# EAGLE design Libbrecht-Hall v3 (EAGLE 9.6.2)
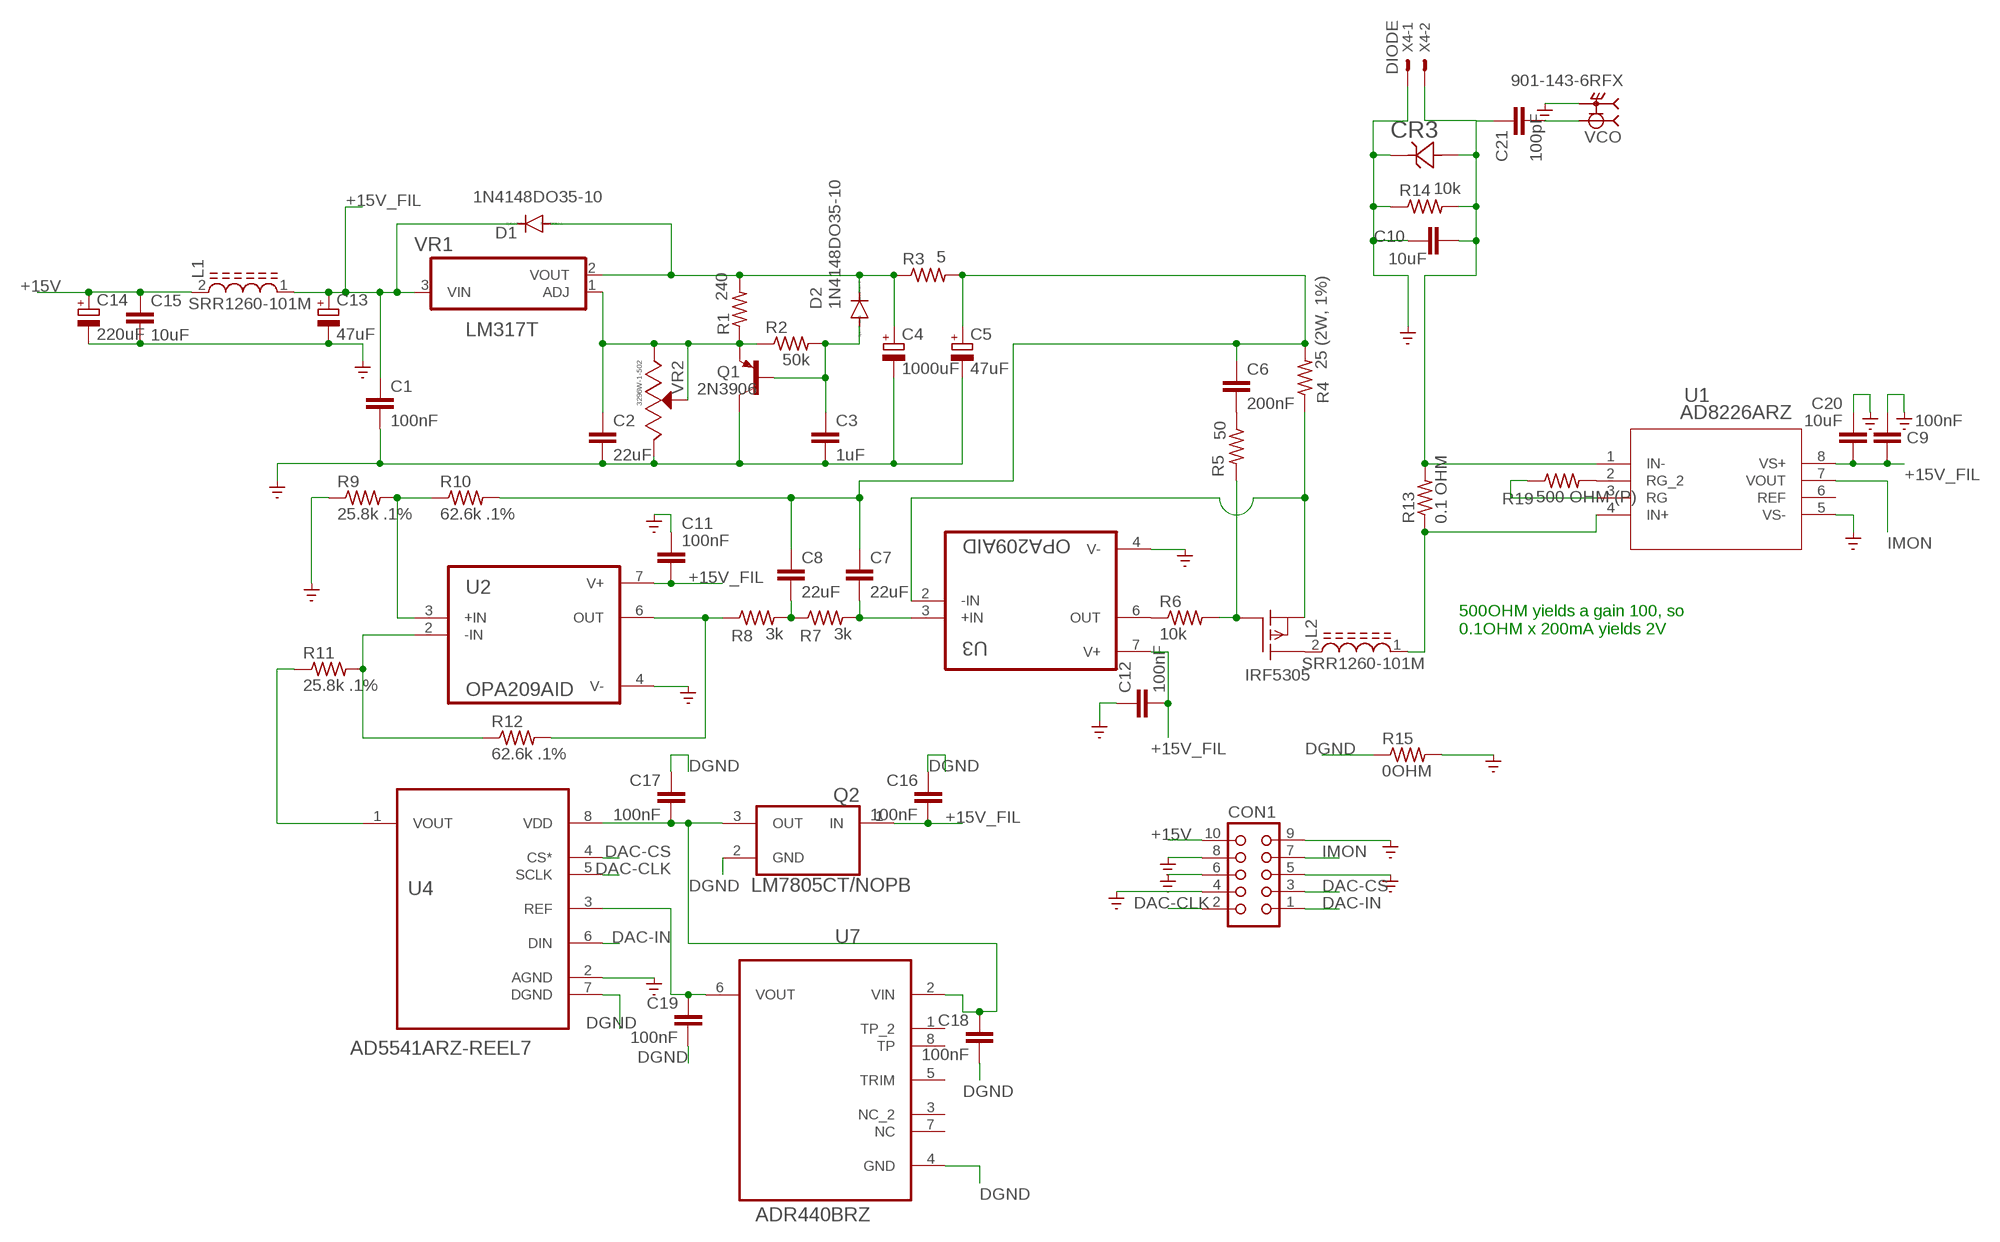
[diagram p0: schematic, sheet 1]

## Parts
C1  100nF  C-EUC1206  [C1206]
C2  22uF  C-EUC1206  [C1206]
C3  1uF  C-EUC1206  [C1206]
C4  1000uF  CPOL-EUE5-13  [E5-13]
C5  47uF  CPOL-EU175TMP-0808  [175TMP-0808]
C6  200nF  C-EUC1206  [C1206]
C7  22uF  C-EUC1206  [C1206]
C8  22uF  C-EUC1206  [C1206]
C9  100nF  C-EUC0603  [C0603]
C10  10uF  C-EUC1206  [C1206]
C11  100nF  C-EUC1206  [C1206]
C12  100nF  C-EUC1206  [C1206]
C13  47uF  CPOL-EU175TMP-0808  [175TMP-0808]
C14  220uF  CPOL-EUE3.5-8  [E3,5-8]
C15  10uF  C-EUC1206  [C1206]
C16  100nF  C-EUC1206  [C1206]
C17  100nF  C-EUC1206  [C1206]
C18  100nF  C-EUC1206  [C1206]
C19  100nF  C-EUC1206  [C1206]
C20  10uF  C-EUC0603  [C0603]
C21  100pF  C-EUC0603  [C0603]
CON1  CON10  [CON10]
CR3  ESDA7P60-1U1MZDO_1610_STM-M  [ZDO_1610_STM-M]
D1  1N4148DO35-10  [DO35-10]
D2  1N4148DO35-10  [DO35-10]
IRF5305  IRF9530  [TO220]
L1  SRR1260-101M  [INDP125125X600N]
L2  SRR1260-101M  [INDP125125X600N]
Q1  2N3906  [TO92]
Q2  LM7805CT/NOPB  [TO254P1054X470X2600-3]
R1  240  R-US_R1206  [R1206]
R2  50k  R-US_R1206  [R1206]
R3  5  R-US_R1206  [R1206]
R4  25 (2W, 1%)  R-US_R1206  [R1206]
R5  50  R-US_R1206  [R1206]
R6  10k  R-US_R1206  [R1206]
R7  3k  R-US_R1206  [R1206]
R8  3k  R-US_R1206  [R1206]
R9  25.8k .1%  R-US_R0603  [R0603]
R10  62.6k .1%  R-US_R0603  [R0603]
R11  25.8k .1%  R-US_R0603  [R0603]
R12  62.6k .1%  R-US_R0603  [R0603]
R13  0.1 OHM  R-US_R1206  [R1206]
R14  10k  R-US_R1206  [R1206]
R15  0OHM  R-US_R1206  [R1206]
R19  500 OHM (P)  R-US_R1206  [R1206]
U1  AD8226ARZ  [R_8_ADI]
U2  OPA209AID  [SOIC127P599X175-8N]
U3  OPA209AID  [SOIC127P599X175-8N]
U4  AD5541ARZ-REEL7  [SOIC127P600X175-8N]
U7  ADR440BRZ  [SOIC127P600X175-8N]
VCO  901-143-6RFX  [AMPHENOL_901-143-6RFX]
VR1  LM317T  [TO254P1054X470X1955-3]
VR2  3296W-1-502  [TRIM_3296W-1-502]
X4  DIODE  JST-XH-02-PIN-LONG-PAD  [JST-XH-02-PACKAGE-LONG-PAD]

## Nets
+15V: C14.+ C15.1 CON1.10 L1.2
+15V_FIL: C1.1 C9.2 C11.2 C12.2 C13.+ C16.2 C20.2 D1.C L1.1 Q2.1(IN) U1.8(VS+) U2.7(V+) U3.7(V+) VR1.3(VIN)
DAC-CLK: CON1.2 U4.5(SCLK)
DAC-CS: CON1.3 U4.4(CS*)
DAC-IN: CON1.1 U4.6(DIN)
DGND: C16.1 C17.1 C18.2 C19.2 Q2.2(GND) R15.1 U4.7(DGND) U7.4(GND)
GND: C1.2 C2.2 C3.2 C4.- C5.- C9.1 C10.1 C11.1 C12.1 C13.- C14.- C15.2 C20.1 CON1.4 CON1.5 CON1.6 CON1.8 CON1.9 CR3.1 Q1.1(C) R9.1 R14.1 R15.2 U1.5(VS-) U2.4(V-) U3.4(V-) U4.2(AGND) VCO.S1 VCO.S2 VCO.S3 VCO.S4 VR2.3(CW) X4.1 ; supply symbol labelled SUPPLY0_GND_
IMON: CON1.7 U1.7(VOUT)
N$1: R11.1 U4.1(VOUT)
N$2: L2.1 R13.1 U1.4(IN+)
N$3: C5.+ C6.1 C7.1 C8.1 R3.2 R4.2 R10.2
N$4: C4.+ D1.A D2.C R1.2 R3.1 VR1.2(VOUT)
N$5: C2.1 Q1.3(E) R1.1 R2.1 VR1.1(ADJ) VR2.1(CCW) VR2.2(WIPER)
N$6: C10.2 C21.1 CR3.2 R13.2 R14.2 U1.1(IN-) X4.2
N$7: C3.1 D2.A Q1.2(B) R2.2
N$8: R6.1 U3.6(OUT)
N$9: R9.2 R10.1 U2.3(+IN)
N$10: C21.2 VCO.1
N$11: C6.2 R5.1
N$12: R19.2 U1.2(RG_2)
N$13: C19.1 U4.3(REF) U7.6(VOUT)
N$14: C17.2 C18.1 Q2.3(OUT) U4.8(VDD) U7.2(VIN)
N$15: IRF5305.2(D) L2.2
N$18: R19.1 U1.3(RG)
N$20: IRF5305.3(S) R4.1 U3.2(-IN)
N$21: C8.2 R7.1 R8.2
N$22: C7.2 R7.2 U3.3(+IN)
N$25: R11.2 R12.1 U2.2(-IN)
N$26: R8.1 R12.2 U2.6(OUT)
N$28: IRF5305.1(G) R5.2 R6.2
Unconnected: U1.6(REF) U7.1(TP_2) U7.3(NC_2) U7.5(TRIM) U7.7(NC) U7.8(TP)

## Notes on the sheet
- 500OHM yields a gain 100, so
  0.1OHM x 200mA yields 2V

## Library data of the parts
C1-C3 C6-C12 C15-C21 = rcl:C-EU: CAPACITOR, European symbol; SPICEPREFIX: C
C4 C5 C13 C14 = rcl:CPOL-EU: POLARIZED CAPACITOR, European symbol; SPICEPREFIX: C
CON1 = con-harting:CON10: CONNECTOR; OC_FARNELL: unknown; OC_NEWARK: unknown
CR3 = ESDA7P60:ESDA7P60-1U1M: STMicro ESD Suppressor / TVS Diode; BUILT_BY: EMA_Cory; COPYRIGHT: Copyright (C) 2018 Accelerated Designs. All rights reserved; DATASHEET: https://www.st.com/content/ccc/resource/technical/document/datasheet/44/e9/26/44/42/ee/4f/e5/DM00139972.pdf/files/DM00139972.pdf/jcr:content/translations/en.DM00139972.pdf; MANUFACTURER_PART_NUMBER: ESDA7P60-1U1M; SOURCELIBRARY: Updates_to_database_2020-11-02; VENDOR: STMicroelectronics
D1 D2 = diode:1N4148: DIODE high speed (Philips)
IRF5305 = transistor-fet:IRF9530: P-Channel Enhancement MOSFET (HEXFET); -100V; -12A; 0,3Ohm
L1 L2 = SRR1260-101M:SRR1260-101M: Inductor Power Shielded Wirewound 33uH 20% 100KHz 27Q-Factor Ferrite 3A 60mOhm DCR T/R Check prices <https://pricing.snapeda.com/parts/SRR1260-101M/Bourns/view-part?ref=eda>; AVAILABILITY: Good; DESCRIPTION: 100µH Shielded Wirewound Inductor 1.7A 180mOhm Max Nonstandard; MF: Bourns; MP: SRR1260-101M; PACKAGE: Nonstandard Bourns; PRICE: None; PURCHASE-URL: https://pricing.snapeda.com/search/part/SRR1260-101M/?ref=eda
Q1 = transistor-pnp:2N3906: PNP Transistor
Q2 = LM7805CT_NOPB:LM7805CT/NOPB: Standard Regulator Pos 5V 1A 3-Pin(3+Tab) TO-220 Rail Check prices <https://pricing.snapeda.com/parts/LM7805CT/ON%20Semiconductor/view-part?ref=eda>; AVAILABILITY: Warning; DESCRIPTION: Linear Voltage Regulator IC Positive Fixed 1 Output 1A TO-220-3; MF: ON Semiconductor; MP: LM7805CT; PACKAGE: TO-220-3 ON Semiconductor; PRICE: None; PURCHASE-URL: https://pricing.snapeda.com/search/part/LM7805CT/?ref=eda
R1-R15 R19 = rcl:R-US_: RESISTOR, American symbol; SPICEPREFIX: R
U1 = AD8226ARZ:AD8226ARZ: AD8226 ARZ INSTRUMENTATION AMPLIFIER; COPYRIGHT: Copyright (C) 2021 Ultra Librarian. All rights reserved.; DIGI-KEY_PART_NUMBER_1: AD8226ARZ-ND; MANUFACTURER_PART_NUMBER: AD8226ARZ; MFR_NAME: Analog Devices Inc
U2 U3 = OPA209AID:OPA209AID; AVAILABILITY: Unavailable; DESCRIPTION: Single, 2.2nV/rtHz, 18MHz, Precision, RRO, 36V Operational Amplifier 8-SOIC -40 to 125; MF: Texas Instruments; MP: OPA209AID; PACKAGE: SOIC-8 Texas Instruments; PRICE: None; PURCHASE-URL: https://pricing.snapeda.com/search/part/OPA209AID/?ref=eda
U4 = AD5541ARZ-REEL7:AD5541ARZ-REEL7: 16-Bit Digital-to-Analog Converters Check prices <https://pricing.snapeda.com/parts/AD5541ARZ/Analog%20Devices/view-part?ref=eda>; AVAILABILITY: Warning; DESCRIPTION: 16 Bit Digital to Analog Converter 1 8-SOIC; MF: Analog Devices; MP: AD5541ARZ; PACKAGE: SOIC-8 Analog Devices; PRICE: None; PURCHASE-URL: https://pricing.snapeda.com/search/part/AD5541ARZ/?ref=eda
U7 = ADR440BRZ:ADR440BRZ: LDO XFET Voltage References; AVAILABILITY: Unavailable; DESCRIPTION: Series Voltage Reference IC ±0.05% 8-SOIC; MF: Analog Devices; MP: ADR440BRZ; PACKAGE: SOIC-8 Analog Devices; PRICE: None
VCO = 901-143-6RFX:901-143-6RFX: connector, rf coaxial, sma rt angle pcb jack recept, 4 legs, blunt post term, gold Check prices <https://pricing.snapeda.com/parts/901-143-6RFX/Amphenol%20RF/view-part?ref=eda>; AVAILABILITY: In Stock; DESCRIPTION: SMA Connector Jack, Female Socket 50Ohm Through Hole, Right Angle Solder; MF: Amphenol RF; MP: 901-143-6RFX; PACKAGE: None; PRICE: None
VR1 = LM317T:LM317T: Check prices <https://pricing.snapeda.com/parts/LM317T/Texas%20Instruments/view-part?ref=eda>; AVAILABILITY: In Stock; DESCRIPTION: 1.5-A, 40-V, adjustable linear voltage regulator 3-TO-220; MF: Texas Instruments; MP: LM317T; PACKAGE: TO-220-3 Texas Instruments; PRICE: None
VR2 = 3296W-1-502:3296W-1-502: Res Cermet Trimmer 500K Ohm 10% 0.5W 25(Elec)Turn 2.19mm (9.53 X 4.83 X 11.55mm) Pin Thru-Hole Tube; DESCRIPTION: 5 kOhms 0.5W, 1/2W PC Pins Through Hole Trimmer Potentiometer Cermet 25 Turn Top Adjustment; DIGI-KEY_PART_NUMBER: 3296W-1-502RLFTR-ND; MF: Bourns; MP: 3296W-1-502; PACKAGE: SOT-23-5 Bourns
X4 = Rembrandt Electronics - JST XH Connectors v1-0:JST-XH-02-PIN: JST XH Connector 2 Pin Wire to board connector. Pitch: 2,54 mm, (0.100") Number of pins: 2 Created by Rembrandt Electronics www.rembrandtelectronics.com

## Net classes
0 default: width 0.14 mm

## Board
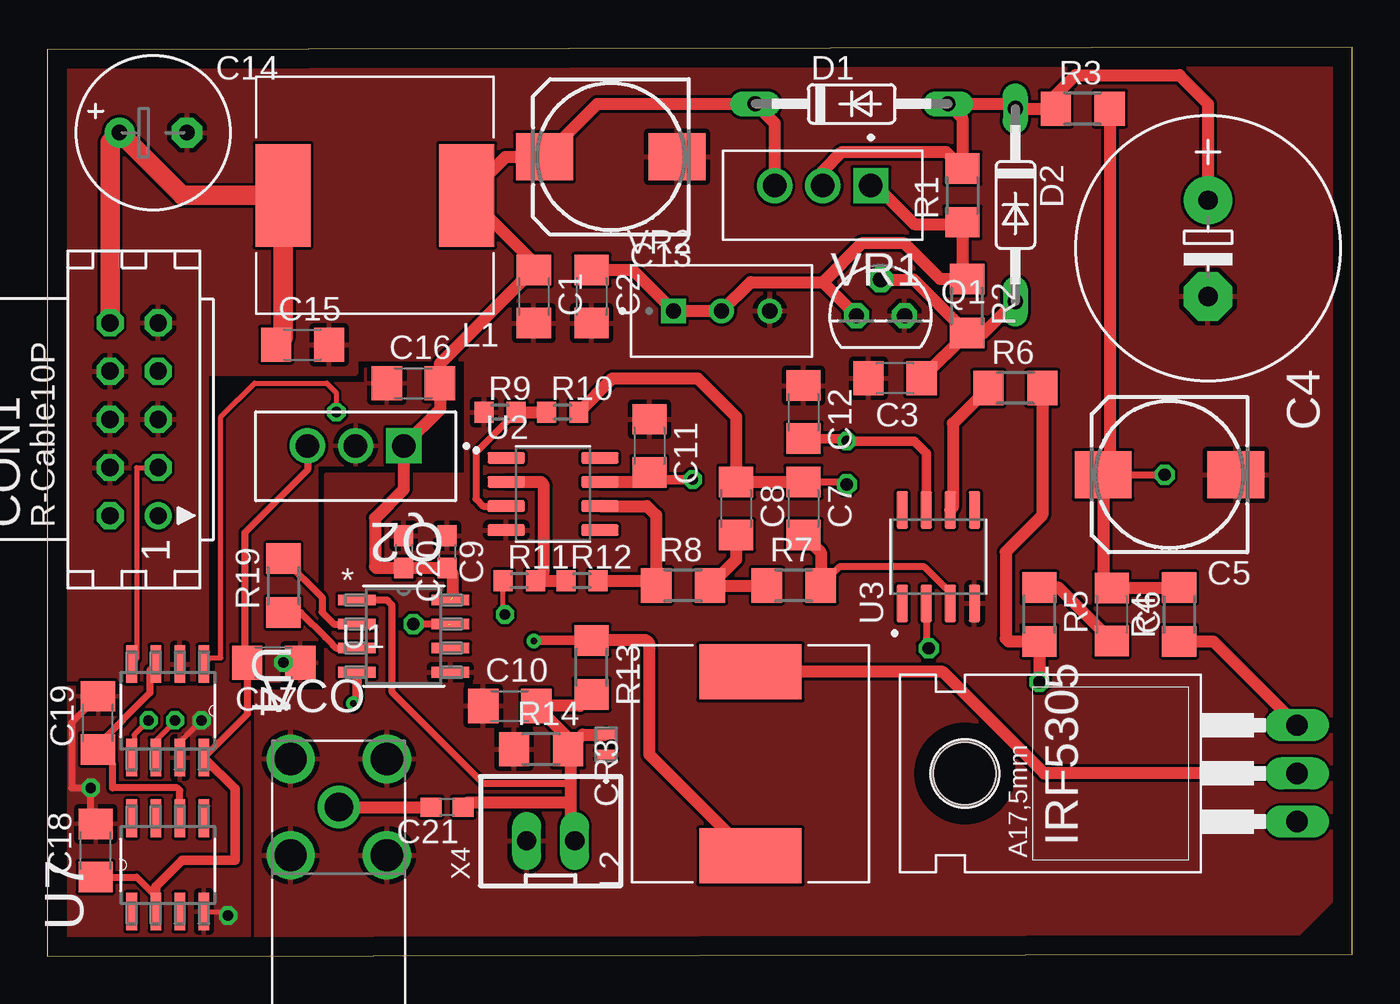
[diagram p1: board, top side]
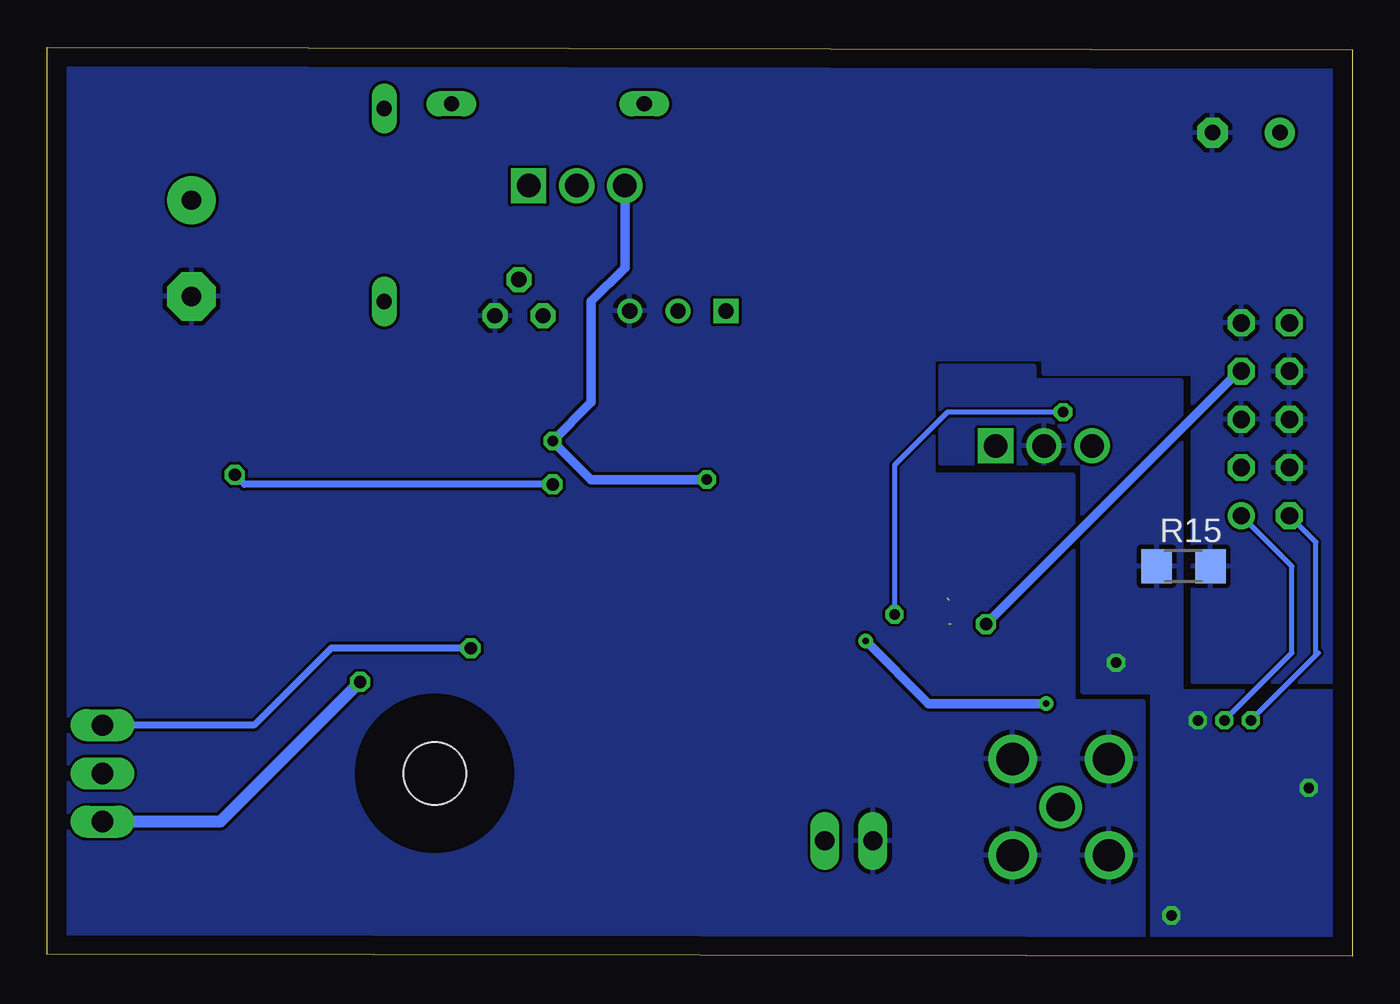
[diagram p2: board, bottom side, seen from below]

Size 68.81 x 47.93 mm. Coordinates in mm from the lower left corner, seen from the top.
Outline: 0,0 68.81,0.13 68.81,47.93 0,47.8 0,0
Copper layers (1*16): Top 0.035mm / dielectric 1.5mm / Bottom 0.035mm
Design rules "default": minimum track width 6mil, minimum drill 0.35mm, track to track 6mil, track to pad 6mil, pad to pad 6mil, via to via 6mil, smd to smd 6mil, copper to edge 40mil, drill to drill 6mil, minimum pad ring 10mil, minimum via ring 8mil, stop-mask expansion 4mil, vias tented up to drill 0mil, thermal gap 10mil

### Footprints (pad centres in the part's own frame; a part is rotated, then mirrored left to right if it is on the bottom)
C1206 = smd 1.6 x 1.8: 1 -1.4,0; 2 1.4,0
E5-13 = drill 1.016 pad 2.54: + -2.54,0 | drill 1.016 pad 2.54 octagon: - 2.54,0
175TMP-0808 = smd 3 x 2.5: + 3.5,0; - -3.5,0
C0603 = smd 1.1 x 1: 1 -0.85,0; 2 0.85,0
E3,5-8 = drill 0.813 pad 1.6: + -1.778,0 | drill 0.813 pad 1.6 octagon: - 1.778,0
CON10 = drill 0.914: 1 -5.08,-1.27 | drill 0.914 octagon: 2 -5.08,1.27; 3 -2.54,-1.27; 4 -2.54,1.27; 5 0,-1.27; 6 0,1.27; 7 2.54,-1.27; 8 2.54,1.27; 9 5.08,-1.27; 10 5.08,1.27
ZDO_1610_STM-M = smd 0.508 x 0.889: 1 -0.521,0; 2 0.521,0
DO35-10 = drill 0.813 long: A 5.08,0; C -5.08,0
TO220 = drill 1.118 long: 1 -2.54,-6.35; 2 0,-6.35; 3 2.54,-6.35 | hole 3.302: 0,11.176
INDP125125X600N = smd 2.9 x 5.4: 1 -4.85,0; 2 4.85,0
TO92 = drill 0.813 octagon: 1 1.27,0; 2 0,1.905; 3 -1.27,0
TO254P1054X470X2600-3 = drill 1.24 square: 1 0,0 | drill 1.24: 2 2.54,0; 3 5.08,0
R1206 = smd 1.6 x 1.803: 1 -1.422,0; 2 1.422,0
R0603 = smd 1 x 1.1: 1 -0.85,0; 2 0.85,0
R_8_ADI = smd 1.981 x 0.559: 1 -2.464,1.905; 2 -2.464,0.635; 3 -2.464,-0.635; 4 -2.464,-1.905; 5 2.464,-1.905; 6 2.464,-0.635; 7 2.464,0.635; 8 2.464,1.905
SOIC127P599X175-8N = smd 1.97 x 0.6: 1 -2.47,1.905; 2 -2.47,0.635; 3 -2.47,-0.635; 4 -2.47,-1.905; 5 2.47,-1.905; 6 2.47,-0.635; 7 2.47,0.635; 8 2.47,1.905
SOIC127P600X175-8N = smd 1.981 x 0.559: 1 -2.464,1.905; 2 -2.464,0.635; 3 -2.464,-0.635; 4 -2.464,-1.905; 5 2.464,-1.905; 6 2.464,-0.635; 7 2.464,0.635; 8 2.464,1.905
AMPHENOL_901-143-6RFX = drill 1.5 pad 2.25: 1 0,0 | drill 1.7 pad 2.55: S1 -2.54,2.54; S2 2.54,2.54; S3 -2.54,-2.54; S4 2.54,-2.54
TO254P1054X470X1955-3 = drill 1.24 square: 1 -2.54,0 | drill 1.24: 2 0,0; 3 2.54,0
TRIM_3296W-1-502 = drill 0.8 square: 1 -2.54,0 | drill 0.8: 2 0,0; 3 2.54,0
JST-XH-02-PACKAGE-LONG-PAD = drill 1.016 long: 1 -1.27,0; 2 1.27,0

### Placement (x,y rotation side)
C1  25.65,34.8 270 top
C2  28.7,34.8 270 top
C3  44.7,30.48 180 top
C4  61.21,37.34 270 top
C5  59.18,25.4 180 top
C6  56.13,18.03 270 top
C7  39.88,23.62 270 top
C8  36.32,23.62 270 top
C9  21.08,21.34 270 top
C10  24.38,13.21 0 top
C11  31.75,26.92 270 top
C12  39.88,28.7 270 top
C13  29.72,42.16 180 top
C14  5.59,43.43 0 top
C15  13.46,32.26 0 top
C16  19.3,30.23 0 top
C17  11.94,15.49 180 top
C18  2.54,5.59 90 top
C19  2.67,12.32 90 top
C20  18.8,21.34 270 top
C21  21.08,7.87 180 top
CON1  4.57,28.32 90 top
CR3  29.46,11.18 90 top
D1  42.42,44.96 0 top
D2  51.05,39.62 270 top
IRF5305  59.56,9.65 90 top
L1  17.27,40.13 180 top
L2  37.08,10.16 90 top
Q1  43.94,33.78 0 top
Q2  18.8,26.92 180 top
R1  48.26,40.13 90 top
R2  48.51,34.29 270 top
R3  54.61,44.7 0 top
R4  59.69,18.03 90 top
R5  52.32,18.03 270 top
R6  51.05,29.97 0 top
R7  39.37,19.56 0 top
R8  33.53,19.56 0 top
R9  23.88,28.7 0 top
R10  27.18,28.7 0 top
R11  24.89,19.81 0 top
R12  28.19,19.81 0 top
R13  28.7,15.24 270 top
R14  26.03,10.92 0 top
R15  8.89,20.57 0 bottom
R19  12.45,19.56 90 top
U1  18.8,16.89 0 top
U2  26.67,24.38 0 top
U3  46.99,21.08 90 top
U4  6.35,12.95 270 top
U7  6.35,4.83 90 top
VCO  15.37,7.87 0 top
VR1  40.89,40.64 180 top
VR2  35.56,34.04 0 top
X4  26.54,6.1 0 top

### Tracks (layer width: path | path; a pad name or v marks a point on that pad's centre or on a via)
+15V
  Top 1.016: CON1.10 3.3,42.93 C14.+ 7.11,40.13 L1.2 12.42,32.62 C15.1
+15V_FIL  (via drill 0.55)  (1 unrouted)
  Top 0.508: C12.2 42.04,27.3 v42.16,27.18 45.72,27.18 46.35,26.54 U3.7 | v34.04,25.15 32.13,25.15 C11.2
  Top 0.635: VR1.3 38.35,43.94 D1.C 29.01,44.96 C13.+ 24.15,42.16 L1.1 25.65,36.6 C1.1 20.7,31.25 C16.2 20.7,28.83 Q2.1 18.8,24.64 17.27,23.11 17.27,20.57 17.36,20.49 C20.2 C9.2 21.36,20.21 21.36,18.92 | U2.7 31.24,25.02 C11.2
  Bottom 0.508: v34.04,25.15 40.13,25.15 v42.16,27.18 40.13,29.21 40.13,34.54 38.35,36.32 VR1.3
DAC-CLK  (via drill 0.55)
  Top 0.254: v5.33,12.45 4.57,11.68 4.57,11.38 4.45,11.25 U4.5
  Bottom 0.254: v5.33,12.45 1.9,15.88 | 1.9,15.88 1.78,16 | 1.9,15.88 1.9,21.84 CON1.2
DAC-CS
  Top 0.254: U4.4 4.7,15.67 4.7,25.78 CON1.3
DAC-IN  (via drill 0.55)
  Top 0.254: v6.73,12.45 6.73,12.4 5.71,11.38 U4.6
  Bottom 0.254: v6.73,12.45 3.18,16 3.18,20.57 CON1.1
DGND  (via drill 0.55)
  Top 0.254: C18.2 2.29,7.24 | U4.7 6.98,11.3 v8.13,12.45 | U7.4 9.32,2.36 v9.53,2.16
  Top 0.381: 2.29,7.24 v2.29,8.89 1.27,8.89 1.27,12.32 C19.2
  other vias: 12.45,15.49
  pour Top: 8.89,14.22 8.89,30.23 16.76,30.23 16.76,30.99 21.59,30.99 21.59,25.91 14.22,25.91 14.22,14.48 10.67,14.48 10.67,0.25 0.76,0.25 0.76,14.22
  pour Bottom: 0.76,13.97 9.02,13.97 9.02,30.35 16.76,30.35 16.76,31.12 21.72,31.12 21.72,26.03 14.35,26.03 14.22,25.91 14.22,13.97 10.54,13.97 10.54,0.13 10.41,0.25 0.76,0.25
GND
  Bottom 0.254: 7.47,21.11 R15.2
  pour Top: 0.76,47.75 67.56,47.75 68.96,46.36 68.96,4.19 64.77,0 11.05,0 11.05,13.97 14.73,13.97 14.73,25.4 22.1,25.4 22.1,31.5 16.26,31.5 16.26,30.73 8.38,30.73 8.38,14.61 0.76,14.61
  pour Bottom: 8.38,30.73 16.26,30.73 16.26,31.5 22.1,31.5 22.1,25.4 14.73,25.4 14.73,13.46 11.05,13.46 11.05,0.13 68.96,0.13 68.96,48.01 0.51,48.01 0.51,14.48 8.38,14.48
IMON  (via drill 0.65)  (1 unrouted)
  Top 0.381: 21.16,17.53 v19.3,17.53
  Bottom 0.508: v19.3,17.53 5.97,30.86 CON1.7
N$1  (via drill 0.55)
  Top 0.254: U4.1 8.58,15.75 9.14,15.75 9.14,28.45 10.92,30.23 14.73,30.23 15.24,29.72 v15.24,28.7 | v24.13,18.03 24.04,18.12 R11.1
  Bottom 0.254: v15.24,28.7 21.34,28.7 24.13,25.91 v24.13,18.03
N$2  (via drill 0.35)
  Top 0.508: 28.68,16.64 R13.1 25.68,16.66 v25.65,16.64 | U1.4 16.33,13.54 v16.13,13.34
  Top 0.635: L2.1 31.75,10.64 31.75,16.51 31.6,16.66 R13.1
  Bottom 0.508: v16.13,13.34 22.35,13.34 v25.65,16.64
N$3  (via drill 0.65)
  Top 0.381: C7.1 42.03,25.02 v42.16,24.89 | C5.+ v58.93,25.4
  Top 0.635: R3.2 56.03,25.75 C5.+ 55.68,19.89 C6.1 59.67,19.43 R4.2 | R10.2 29.81,30.48 34.29,30.48 36.32,28.45 C8.1 C7.1
  Bottom 0.381: v42.16,24.89 58.42,24.89 v58.93,25.4
N$4
  Top 0.635: VR1.2 40.89,41.4 41.91,42.42 47.4,42.42 R1.2 48.26,44.2 D1.A 50.8,44.96 D2.C R3.1 53.19,45.43 54.23,46.47 59.7,46.47 61.21,44.96 C4.+
N$5
  Top 0.635: C2.1 30.86,36.2 VR2.1 VR2.2 37.08,35.56 40.89,35.56 | 40.89,35.56 Q1.3 | VR1.1 43.69,40.64 45.72,38.61 48.16,38.61 R1.1 48.26,35.97 R2.1 47.09,35.71 45.21,37.59 42.93,37.59 40.89,35.56
N$6
  Top 0.381: U1.1 17.91,18.8 18.03,18.67 18.16,18.54 18.16,13.97 22.99,9.14 27.58,9.14
  Top 0.635: R13.2 28.09,13.21 C10.2 27.46,11.54 R14.2 | R14.2 28.23,11.7 CR3.2 | R14.2 27.58,10.8 27.58,9.14 27.58,8.13 | X4.2 27.58,6.33 27.58,8.13 | C21.1 22.19,8.13 27.58,8.13
N$7
  Top 0.635: Q1.2 45.7,35.69 R2.2 | R2.2 49.38,32.87 D2.A | R2.2 46.13,30.48 C3.1
N$8
  Top 0.635: R6.1 47.75,28.09 47.75,23.68 U3.6
N$9
  Top 0.381: R9.2 22.61,26.58 22.61,24.13 22.99,23.75 U2.3
  Top 0.635: R9.2 R10.1
N$10
  Top 0.635: VCO.1 C21.2
N$11
  Top 0.635: R5.1 53.31,19.46 C6.2
N$12
  Top 0.381: R19.2 14.48,18.95 14.48,18.16 15.11,17.53 U1.2
N$13
  Top 0.381: U7.6 6.98,8.76 6.86,8.89 3.43,8.89 3.43,10.16 C19.1 2.67,11.17 5.4,13.91 5.4,15.1 U4.3
N$14
  Top 0.381: Q2.3 13.72,25.65 10.41,22.35 10.41,15.62 C17.2 10.54,12.77 U4.8 | C18.1 4.7,4.19 5.71,3.18 U7.2
  Top 0.508: U7.2 5.71,3.68 7.11,5.08 9.91,5.08 9.91,8.84 U4.8
N$15
  Top 0.635: IRF5305.2 52.58,9.65 47.22,15.01 L2.2
N$18
  Top 0.381: R19.1 13.36,18.14 14.67,16.83 14.81,16.69 15.24,16.26 U1.3
N$20  (via drill 0.65)
  Top 0.381: U3.2 46.35,16.38 v46.48,16.26
  Top 0.635: R4.1 61.49,16.61 IRF5305.3
  Bottom 0.381: v46.48,16.26 53.85,16.26 57.91,12.19 IRF5305.3
N$21
  Top 0.635: C8.2 36.32,20.93 R8.2 R7.1
N$22
  Top 0.381: R7.2 41.81,20.57 46.23,20.57 47.62,19.18 U3.3
  Top 0.635: C7.2 40.79,21.31 R7.2
N$25
  Top 0.635: R12.1 R11.2 26.16,20.23 26.16,24.89 26.03,25.02 U2.2
N$26
  Top 0.635: R12.2 31.85,19.81 R8.1 32.11,23.27 31.62,23.75 U2.6
N$28  (via drill 0.65)
  Top 0.635: R6.2 52.48,23.27 50.55,21.34 50.55,16.76 50.7,16.61 R5.2 v52.32,14.48
  Bottom 0.635: v52.32,14.48 59.69,7.11 IRF5305.1